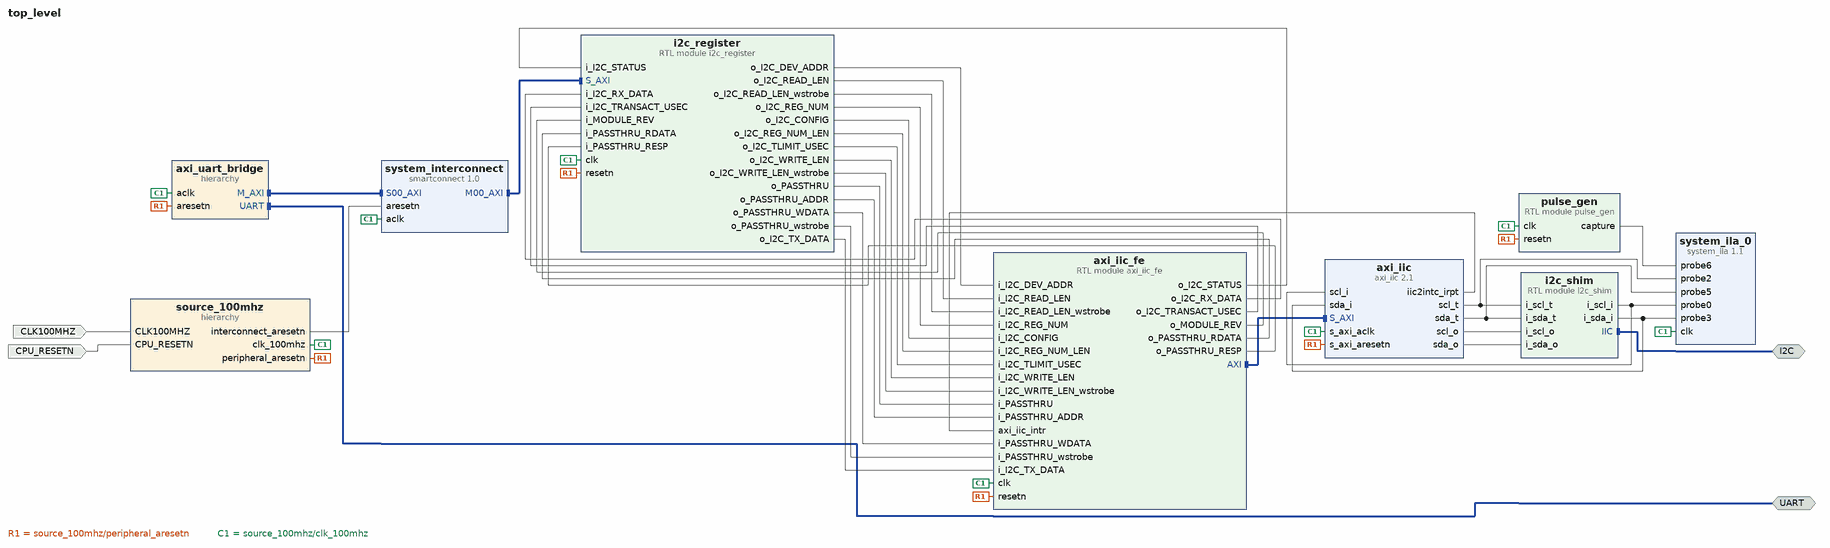
[diagram p0: block diagram of the top level]
# Vivado block design top_level, xc7a100tcsg324-1, Vivado 2021.1
create_bd_design top_level

create_bd_intf_port -mode Master -vlnv xilinx.com:interface:uart_rtl:1.0 UART
create_bd_intf_port -mode Master -vlnv xilinx.com:interface:iic_rtl:1.0 I2C
create_bd_port -dir I -type clk CLK100MHZ
set_property -dict {CONFIG.ASSOCIATED_RESET CPU_RESETN} [get_bd_ports CLK100MHZ]
create_bd_port -dir I -type rst CPU_RESETN

create_bd_cell -type hier source_100mhz
create_bd_cell -type hier axi_uart_bridge
create_bd_cell -type ip -vlnv xilinx.com:ip:axi_iic:2.1 axi_iic
set_property -dict {CONFIG.IIC_BOARD_INTERFACE Custom CONFIG.USE_BOARD_FLOW true} [get_bd_cells axi_iic]
create_bd_cell -type ip -vlnv xilinx.com:ip:smartconnect:1.0 system_interconnect
set_property -dict {CONFIG.NUM_MI 1 CONFIG.NUM_SI 2} [get_bd_cells system_interconnect]
create_bd_cell -type module -reference i2c_shim i2c_shim
create_bd_cell -type ip -vlnv xilinx.com:ip:system_ila:1.1 system_ila_0
set_property -dict [list \
  CONFIG.ALL_PROBE_SAME_MU_CNT 2 \
  CONFIG.C_EN_STRG_QUAL 1 \
  CONFIG.C_MON_TYPE NATIVE \
  CONFIG.C_NUM_OF_PROBES 7 \
  CONFIG.C_PROBE0_MU_CNT 2 \
  CONFIG.C_PROBE1_MU_CNT 2 \
  CONFIG.C_PROBE2_MU_CNT 2 \
  CONFIG.C_PROBE3_MU_CNT 2 \
  CONFIG.C_PROBE4_MU_CNT 2 \
  CONFIG.C_PROBE5_MU_CNT 2 \
  CONFIG.C_PROBE6_MU_CNT 2 \
] [get_bd_cells system_ila_0]
create_bd_cell -type module -reference axi_iic_fe axi_iic_fe
create_bd_cell -type module -reference i2c_register i2c_register
create_bd_cell -type module -reference pulse_gen pulse_gen

# ---- hierarchy /source_100mhz ----
current_bd_instance /source_100mhz
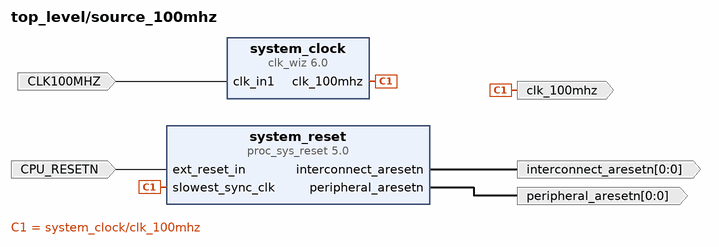
[diagram p1: block diagram inside /source_100mhz]
create_bd_pin -dir I -type clk CLK100MHZ
create_bd_pin -dir O -type clk clk_100mhz
create_bd_pin -dir I -type rst CPU_RESETN
create_bd_pin -dir O -from 0 -to 0 -type rst interconnect_aresetn
create_bd_pin -dir O -from 0 -to 0 -type rst peripheral_aresetn

create_bd_cell -type ip -vlnv xilinx.com:ip:clk_wiz:6.0 system_clock
set_property -dict [list \
  CONFIG.CLKOUT1_DRIVES BUFGCE \
  CONFIG.CLKOUT2_DRIVES BUFGCE \
  CONFIG.CLKOUT3_DRIVES BUFGCE \
  CONFIG.CLKOUT4_DRIVES BUFGCE \
  CONFIG.CLKOUT5_DRIVES BUFGCE \
  CONFIG.CLKOUT6_DRIVES BUFGCE \
  CONFIG.CLKOUT7_DRIVES BUFGCE \
  CONFIG.CLK_OUT1_PORT clk_100mhz \
  CONFIG.FEEDBACK_SOURCE FDBK_AUTO \
  CONFIG.USE_LOCKED false \
  CONFIG.USE_RESET false \
  CONFIG.USE_SAFE_CLOCK_STARTUP true \
] [get_bd_cells system_clock]
create_bd_cell -type ip -vlnv xilinx.com:ip:proc_sys_reset:5.0 system_reset

# ---- hierarchy /axi_uart_bridge ----
current_bd_instance /axi_uart_bridge
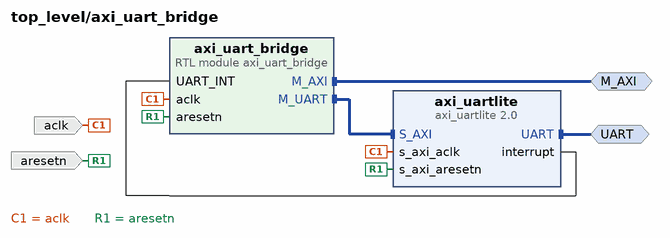
[diagram p2: block diagram inside /axi_uart_bridge]
create_bd_intf_pin -mode Master -vlnv xilinx.com:interface:aximm_rtl:1.0 M_AXI
create_bd_intf_pin -mode Master -vlnv xilinx.com:interface:uart_rtl:1.0 UART
create_bd_pin -dir I -type rst aresetn
create_bd_pin -dir I -type clk aclk

create_bd_cell -type module -reference axi_uart_bridge axi_uart_bridge
create_bd_cell -type ip -vlnv xilinx.com:ip:axi_uartlite:2.0 axi_uartlite
set_property -dict {CONFIG.C_BAUDRATE 115200} [get_bd_cells axi_uartlite]

# ---- connections ----

current_bd_instance /source_100mhz
connect_bd_net [get_bd_pins CLK100MHZ] [get_bd_pins system_clock/clk_in1]
connect_bd_net [get_bd_pins CPU_RESETN] [get_bd_pins system_reset/ext_reset_in]
connect_bd_net [get_bd_pins system_clock/clk_100mhz] [get_bd_pins clk_100mhz] [get_bd_pins system_reset/slowest_sync_clk]
connect_bd_net [get_bd_pins system_reset/interconnect_aresetn] [get_bd_pins interconnect_aresetn]
connect_bd_net [get_bd_pins system_reset/peripheral_aresetn] [get_bd_pins peripheral_aresetn]

current_bd_instance /axi_uart_bridge
connect_bd_intf_net [get_bd_intf_pins M_AXI] [get_bd_intf_pins axi_uart_bridge/M_AXI]
connect_bd_intf_net [get_bd_intf_pins UART] [get_bd_intf_pins axi_uartlite/UART]
connect_bd_intf_net [get_bd_intf_pins axi_uart_bridge/M_UART] [get_bd_intf_pins axi_uartlite/S_AXI]
connect_bd_net [get_bd_pins aclk] [get_bd_pins axi_uart_bridge/aclk] [get_bd_pins axi_uartlite/s_axi_aclk]
connect_bd_net [get_bd_pins aresetn] [get_bd_pins axi_uart_bridge/aresetn] [get_bd_pins axi_uartlite/s_axi_aresetn]
connect_bd_net [get_bd_pins axi_uartlite/interrupt] [get_bd_pins axi_uart_bridge/UART_INT]

current_bd_instance /
connect_bd_intf_net [get_bd_intf_pins axi_iic_fe/AXI] [get_bd_intf_pins axi_iic/S_AXI]
connect_bd_intf_net -intf_net hier_0_M_AXI [get_bd_intf_pins system_interconnect/S00_AXI] [get_bd_intf_pins axi_uart_bridge/M_AXI]
connect_bd_intf_net -intf_net hier_0_UART [get_bd_intf_ports UART] [get_bd_intf_pins axi_uart_bridge/UART]
connect_bd_intf_net -intf_net i2c_shim_0_IIC [get_bd_intf_ports I2C] [get_bd_intf_pins i2c_shim/IIC]
connect_bd_intf_net [get_bd_intf_pins system_interconnect/M00_AXI] [get_bd_intf_pins i2c_register/S_AXI]
connect_bd_net [get_bd_ports CLK100MHZ] [get_bd_pins source_100mhz/CLK100MHZ]
connect_bd_net [get_bd_ports CPU_RESETN] [get_bd_pins source_100mhz/CPU_RESETN]
# net alarm has one end: 
connect_bd_net -net axi_iic_0_iic2intc_irpt [get_bd_pins axi_iic/iic2intc_irpt] [get_bd_pins axi_iic_fe/axi_iic_intr]
connect_bd_net -net axi_iic_fe_o_I2C_IDLE [get_bd_pins axi_iic_fe/o_I2C_STATUS] [get_bd_pins i2c_register/i_I2C_STATUS]
connect_bd_net [get_bd_pins axi_iic_fe/o_I2C_RX_DATA] [get_bd_pins i2c_register/i_I2C_RX_DATA]
connect_bd_net [get_bd_pins axi_iic_fe/o_I2C_TRANSACT_USEC] [get_bd_pins i2c_register/i_I2C_TRANSACT_USEC]
connect_bd_net [get_bd_pins axi_iic_fe/o_MODULE_REV] [get_bd_pins i2c_register/i_MODULE_REV]
connect_bd_net [get_bd_pins axi_iic_fe/o_PASSTHRU_RDATA] [get_bd_pins i2c_register/i_PASSTHRU_RDATA]
connect_bd_net [get_bd_pins axi_iic_fe/o_PASSTHRU_RESP] [get_bd_pins i2c_register/i_PASSTHRU_RESP]
connect_bd_net -net capture [get_bd_pins pulse_gen/capture] [get_bd_pins system_ila_0/probe6]
connect_bd_net -net i2c_register_0_o_I2C_DEV_ADDR [get_bd_pins i2c_register/o_I2C_DEV_ADDR] [get_bd_pins axi_iic_fe/i_I2C_DEV_ADDR]
connect_bd_net -net i2c_register_0_o_I2C_READ_LEN [get_bd_pins i2c_register/o_I2C_READ_LEN] [get_bd_pins axi_iic_fe/i_I2C_READ_LEN]
connect_bd_net -net i2c_register_0_o_I2C_READ_LEN_wstrobe [get_bd_pins i2c_register/o_I2C_READ_LEN_wstrobe] \
  [get_bd_pins axi_iic_fe/i_I2C_READ_LEN_wstrobe]
connect_bd_net -net i2c_register_0_o_I2C_REG_NUM [get_bd_pins i2c_register/o_I2C_REG_NUM] [get_bd_pins axi_iic_fe/i_I2C_REG_NUM]
connect_bd_net [get_bd_pins i2c_register/o_I2C_CONFIG] [get_bd_pins axi_iic_fe/i_I2C_CONFIG]
connect_bd_net [get_bd_pins i2c_register/o_I2C_REG_NUM_LEN] [get_bd_pins axi_iic_fe/i_I2C_REG_NUM_LEN]
connect_bd_net [get_bd_pins i2c_register/o_I2C_TLIMIT_USEC] [get_bd_pins axi_iic_fe/i_I2C_TLIMIT_USEC]
connect_bd_net [get_bd_pins i2c_register/o_I2C_WRITE_LEN] [get_bd_pins axi_iic_fe/i_I2C_WRITE_LEN]
connect_bd_net [get_bd_pins i2c_register/o_I2C_WRITE_LEN_wstrobe] [get_bd_pins axi_iic_fe/i_I2C_WRITE_LEN_wstrobe]
connect_bd_net [get_bd_pins i2c_register/o_PASSTHRU] [get_bd_pins axi_iic_fe/i_PASSTHRU]
connect_bd_net [get_bd_pins i2c_register/o_PASSTHRU_ADDR] [get_bd_pins axi_iic_fe/i_PASSTHRU_ADDR]
connect_bd_net [get_bd_pins i2c_register/o_PASSTHRU_WDATA] [get_bd_pins axi_iic_fe/i_PASSTHRU_WDATA]
connect_bd_net [get_bd_pins i2c_register/o_PASSTHRU_wstrobe] [get_bd_pins axi_iic_fe/i_PASSTHRU_wstrobe]
connect_bd_net -net o_I2C_TX_DATA [get_bd_pins i2c_register/o_I2C_TX_DATA] [get_bd_pins axi_iic_fe/i_I2C_TX_DATA]
connect_bd_net -net scl_i [get_bd_pins i2c_shim/i_scl_i] [get_bd_pins axi_iic/scl_i] [get_bd_pins system_ila_0/probe0]
connect_bd_net -net scl_o [get_bd_pins axi_iic/scl_o] [get_bd_pins i2c_shim/i_scl_o]
connect_bd_net -net scl_t [get_bd_pins axi_iic/scl_t] [get_bd_pins i2c_shim/i_scl_t] [get_bd_pins system_ila_0/probe2]
connect_bd_net -net sda_i [get_bd_pins i2c_shim/i_sda_i] [get_bd_pins axi_iic/sda_i] [get_bd_pins system_ila_0/probe3]
connect_bd_net -net sda_o [get_bd_pins axi_iic/sda_o] [get_bd_pins i2c_shim/i_sda_o]
connect_bd_net -net sda_t [get_bd_pins axi_iic/sda_t] [get_bd_pins i2c_shim/i_sda_t] [get_bd_pins system_ila_0/probe5]
connect_bd_net [get_bd_pins source_100mhz/interconnect_aresetn] [get_bd_pins system_interconnect/aresetn]
connect_bd_net [get_bd_pins source_100mhz/peripheral_aresetn] \
  [get_bd_pins axi_uart_bridge/aresetn] [get_bd_pins axi_iic/s_axi_aresetn] [get_bd_pins axi_iic_fe/resetn] \
  [get_bd_pins i2c_register/resetn] [get_bd_pins pulse_gen/resetn]
connect_bd_net -net system_clock_clk_100mhz [get_bd_pins source_100mhz/clk_100mhz] \
  [get_bd_pins axi_uart_bridge/aclk] [get_bd_pins axi_iic/s_axi_aclk] [get_bd_pins system_interconnect/aclk] \
  [get_bd_pins system_ila_0/clk] [get_bd_pins axi_iic_fe/clk] [get_bd_pins i2c_register/clk] [get_bd_pins pulse_gen/clk]
set_property HDL_ATTRIBUTE.DEBUG true [get_bd_nets alarm]
set_property HDL_ATTRIBUTE.MARK_DEBUG true [get_bd_nets alarm]

# ---- address map ----
assign_bd_address -offset 0x00000000 -range 128 -target_address_space [get_bd_addr_spaces axi_iic_fe/AXI] [get_bd_addr_segs axi_iic/S_AXI/Reg]
assign_bd_address -offset 0x0000000000003000 -range 128 -target_address_space [get_bd_addr_spaces axi_uart_bridge/axi_uart_bridge/M_AXI] [get_bd_addr_segs i2c_register/S_AXI/reg0]
assign_bd_address -offset 0x40600000 -range 1K -target_address_space [get_bd_addr_spaces axi_uart_bridge/axi_uart_bridge/M_UART] [get_bd_addr_segs axi_uart_bridge/axi_uartlite/S_AXI/Reg]

validate_bd_design
save_bd_design
